# Altium schematic sheet Interface.SchDoc: a_card
size A4; Author: 劉東輝; SheetNumber: 5; SheetTotal: 5; Unit: 接口; Edition: V1.5
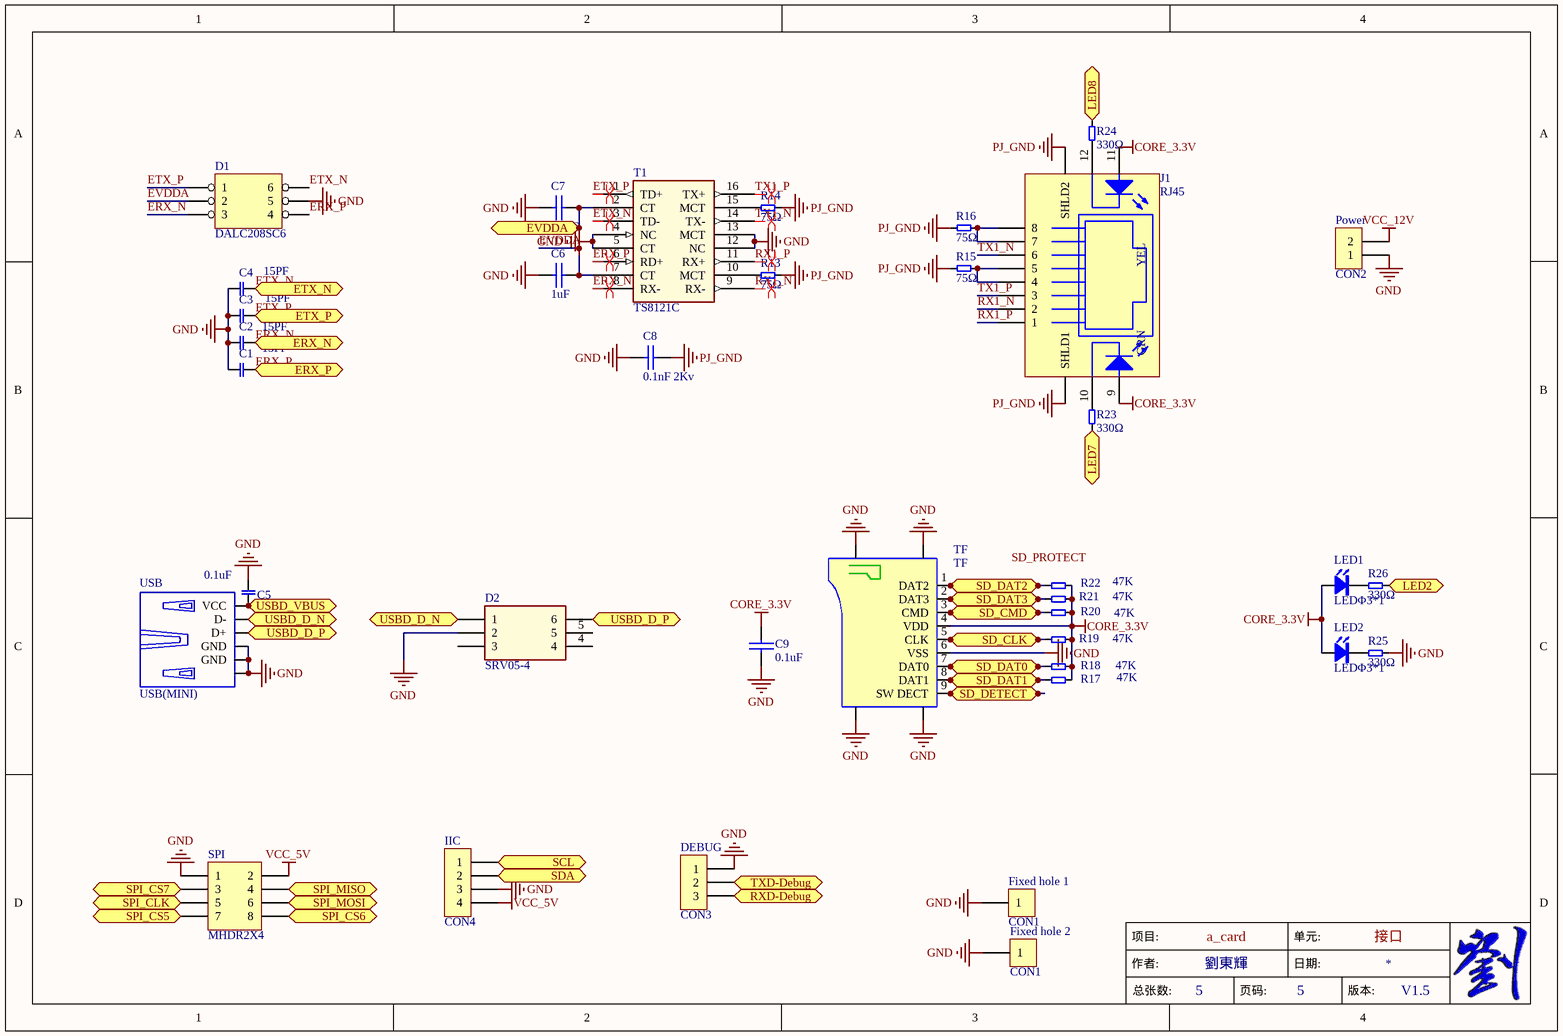
[diagram p0: Interface.SchDoc]

## Parts
C1  15PF  [0805/2012 C3]
C2  15PF  [0805/2012 C3]
C3  15PF  [0805/2012 C3]
C4  15PF  [0805/2012 C3]
C5  0.1uF  [0805/2012 C3]
C6  1uF  [0805/2012 C3]
C7  0.1uF  [0805/2012 C3]
C8  0.1nF 2Kv  [CAPRR508-350X650X700]
C9  0.1uF  [0805/2012 C3]
D1  DALC208SC6  [TSOT-23_6]
D2  SRV05-4  [TSOT-23_6]
DEBUG  CON3  [COMATEL_385.0358.1.03.400]
Fixed_hole_1  CON1  [CON_90]
Fixed_hole_2  CON1  [CON_90]
IIC  CON4  [COMATEL_385.0358.1.04.400]
J1  RJ45  [AMPHENOL_RJHSE-5381]
LED1  LEDΦ3*1  [LED_DIALIGHT_551-1307F]
LED2  LEDΦ3*1  [LED_DIALIGHT_551-1107F]
Power  CON2  [B2P-VH]
R13  75Ω  [0805/2012 R3]
R14  75Ω  [0805/2012 R3]
R15  75Ω  [0805/2012 R3]
R16  75Ω  [0805/2012 R3]
R17  47K  [0805/2012 R3]
R18  47K  [0805/2012 R3]
R19  47K  [0805/2012 R3]
R20  47K  [0805/2012 R3]
R21  47K  [0805/2012 R3]
R22  47K  [0805/2012 R3]
R23  330Ω  [0805/2012 R3]
R24  330Ω  [0805/2012 R3]
R25  330Ω  [0805/2012 R3]
R26  330Ω  [0805/2012 R3]
SPI  MHDR2X4  [M20N-2X04-2.54]
T1  TS8121C  [XFMR_PULSE_H1260NL]
TF  TF  [TFP09-2-12B-G]
USB  USB(MINI)  [WURTH_651005136521]

## Ports
ERX_N (bidir), ERX_P (bidir), ETX_N (bidir), ETX_P (bidir), EVDDA (bidir), LED2 (bidir), LED7 (bidir), LED8 (bidir), RXD-Debug (bidir), SCL (bidir), SD_CLK (bidir), SD_CMD (bidir), SD_DAT0 (bidir), SD_DAT1 (bidir), SD_DAT2 (bidir), SD_DAT3 (bidir), SD_DETECT (bidir), SDA (bidir), SPI_CLK (bidir), SPI_CS5 (bidir), SPI_CS6 (bidir), SPI_CS7 (bidir), SPI_MISO (bidir), SPI_MOSI (bidir), TXD-Debug (bidir), USBD_D_N (bidir), USBD_D_P (bidir), USBD_VBUS (bidir)

## Nets
CORE_3.3V: C9.1 J1.9 J1.11 LED1.1(1A) LED2.1(1A) R17.2 R18.2 R19.2 R20.2 R21.2 R22.2 TF.4(VDD)
GND: C1.2 C2.2 C3.1 C4.2 C5.1 C6.1 C7.1 C8.2 C9.2 D1.5 D2.2 DEBUG.1 Fixed_hole_1.1 Fixed_hole_2.1 IIC.3 Power.1 R25.2 SPI.1 T1.4(NC) T1.5(CT) T1.12(NC) T1.13(MCT) TF.6(VSS) TF.10(GND) TF.11(GND) TF.12(GND) TF.13(GND) USB.4(GND) USB.5(GND) USB.6
PJ_GND: C8.1 J1.13(SHLD2) R13.2 R14.2 R15.1 R16.1
VCC_5V: IIC.4 SPI.2
VCC_12V: Power.2
ERX_N: C2.1 D1.3 T1.8(RX-) ; port ERX_N
ERX_P: C1.1 D1.4 T1.6(RD+) ; port ERX_P
ETX_N: C4.1 D1.6 T1.3(TD-) ; port ETX_N
ETX_P: C3.2 D1.1 T1.1(TD+) ; port ETX_P
EVDDA: C6.2 C7.2 D1.2 T1.2(CT) T1.7(CT) ; port EVDDA
LED2: R26.2 ; port LED2
LED7: R23.1 ; port LED7
LED8: R24.2 ; port LED8
RX1_N: J1.2 T1.9(RX-)
RX1_P: J1.1 T1.11(RX+)
RXD-Debug: DEBUG.3 ; port RXD-Debug
SCL: IIC.1 ; port SCL
SD_CLK: R19.1 TF.5(CLK) ; port SD_CLK
SD_CMD: R20.1 TF.3(CMD) ; port SD_CMD
SD_DAT0: R18.1 TF.7(DAT0) ; port SD_DAT0
SD_DAT1: R17.1 TF.8(DAT1) ; port SD_DAT1
SD_DAT2: R22.1 TF.1(DAT2) ; port SD_DAT2
SD_DAT3: R21.1 TF.2(DAT3) ; port SD_DAT3
SD_DETECT: TF.9(SW_DECT) ; port SD_DETECT
SDA: IIC.2 ; port SDA
SPI_CLK: SPI.5 ; port SPI_CLK
SPI_CS5: SPI.7 ; port SPI_CS5
SPI_CS6: SPI.8 ; port SPI_CS6
SPI_CS7: SPI.3 ; port SPI_CS7
SPI_MISO: SPI.4 ; port SPI_MISO
SPI_MOSI: SPI.6 ; port SPI_MOSI
TX1_N: J1.6 T1.14(TX-)
TX1_P: J1.3 T1.16(TX+)
TXD-Debug: DEBUG.2 ; port TXD-Debug
USBD_D_N: D2.1 USB.2(D-) ; port USBD_D_N
USBD_D_P: D2.6 USB.3(D+) ; port USBD_D_P
USBD_VBUS: C5.2 USB.1(VCC) ; port USBD_VBUS
NetJ1_4: J1.4 J1.5 R15.2
NetJ1_7: J1.7 J1.8 R16.2
NetJ1_10: J1.10 R23.2
NetJ1_12: J1.12 R24.1
NetLED1_2: LED1.2(1K) R26.1
NetLED2_2: LED2.2(1K) R25.1
NetR13_1: R13.1 T1.10(MCT)
NetR14_1: R14.1 T1.15(MCT)

Not connected (* = marked no-connect by the designer): D2 3 4 5

## Layout directives
differential pair: ERX_N, ERX_P, ETX_N, ETX_P, RX1_N, RX1_P, TX1_N, TX1_P

## Notes on the sheet
- Labels drawn without touching a wire or pin: SD_PROTECT
- 项目:
- 作者:
- 总张数:
- 页码:
- 日期:
- 单元:
- 版本:
- (in symbol RJHSE-5381) YEL; GRN

## Library data of the parts
C1-C5 = CAP: Capacitor
C6-C9 = Pro39.tmp_22P_32
D1 = HEADER 3X2
DEBUG = CON3: Connector
Fixed_hole_1 Fixed_hole_2 = CON1: Connector
IIC = CON4: Connector
J1 = RJHSE-5381: 不带网络变压器; Part_Type: Connector; Manufacturer: XMultiple; Manufacturer_Part_Number: XMG-9799-8821-100D-L1TO-H-HIM; Internal_ID: 1001971; Symbol: RJ45_XMG-9799-8821; Component_Life_Cycle_State: Reviewed; Area: 337; Project: iMX6UL+PMIC; Digi_PN: 18000733; Package_Type: TH; ComponentLink1URL: //msp-file/public/Datasheet Repository/XMultiple/XMG-9799-8821-100D-L1TO-H-HIM.pdf; ComponentLink1Description: Manufacturer datasheet; ComponentLink2Description: Manufacturer Alt 1 datasheet; ComponentLink3Description: Manufacturer Alt 2 datasheet; ComponentLink4Description: Manufacturer Alt 3 datasheet; Height: 13,6; RoHS: 1
Power = CON2: Connector
R13-R26 = RES2: Resistor
SPI = MHDR2X4: Header, 4-Pin, Dual row
USB = USB(MINI): USB-MINI